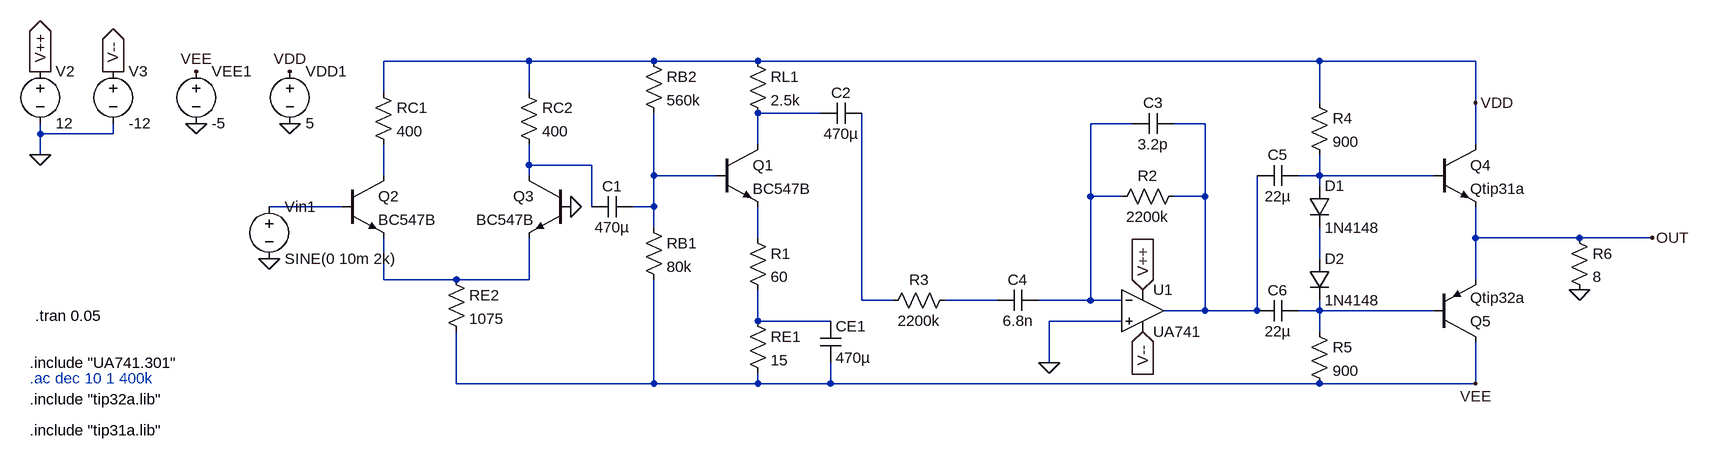
[diagram p0: schematic final.asc]
final.asc, the LTspice schematic file:
Version 4
SHEET 1 2324 1224
WIRE 528 480 304 480
WIRE 720 480 528 480
WIRE 880 480 720 480
WIRE 1744 480 880 480
WIRE 1984 480 1744 480
WIRE 304 528 304 480
WIRE 528 528 528 480
WIRE 1744 544 1744 480
WIRE 1984 544 1984 480
WIRE 976 560 880 560
WIRE 1456 576 1392 576
WIRE 1568 576 1520 576
WIRE -224 592 -224 576
WIRE -112 592 -112 576
WIRE -112 592 -224 592
WIRE 880 608 880 560
WIRE 1984 608 1984 544
WIRE -224 624 -224 592
WIRE 528 640 528 608
WIRE 624 640 528 640
WIRE 304 656 304 608
WIRE 528 656 528 640
WIRE 720 656 720 560
WIRE 816 656 720 656
WIRE 1744 656 1744 624
WIRE 1744 656 1712 656
WIRE 1920 656 1744 656
WIRE 1744 672 1744 656
WIRE 1392 688 1392 576
WIRE 1440 688 1392 688
WIRE 1568 688 1568 576
WIRE 1568 688 1520 688
WIRE 240 704 128 704
WIRE 624 704 624 640
WIRE 720 704 720 656
WIRE 720 704 688 704
WIRE 720 736 720 704
WIRE 880 752 880 704
WIRE 1984 752 1984 704
WIRE 2144 752 1984 752
WIRE 2256 752 2144 752
WIRE 1744 784 1744 736
WIRE 304 816 304 752
WIRE 416 816 304 816
WIRE 528 816 528 752
WIRE 528 816 416 816
WIRE 1984 816 1984 752
WIRE 1040 848 1040 560
WIRE 1088 848 1040 848
WIRE 1248 848 1168 848
WIRE 1392 848 1392 688
WIRE 1392 848 1312 848
WIRE 1440 848 1392 848
WIRE 1568 864 1568 688
WIRE 1568 864 1504 864
WIRE 1648 864 1648 656
WIRE 1648 864 1568 864
WIRE 1744 864 1744 848
WIRE 1744 864 1712 864
WIRE 1920 864 1744 864
WIRE 880 880 880 832
WIRE 992 880 880 880
WIRE 1440 880 1328 880
WIRE 1744 896 1744 864
WIRE 1328 944 1328 880
WIRE 416 976 416 896
WIRE 720 976 720 816
WIRE 720 976 416 976
WIRE 880 976 880 960
WIRE 880 976 720 976
WIRE 992 976 992 944
WIRE 992 976 880 976
WIRE 1744 976 992 976
WIRE 1984 976 1984 912
WIRE 1984 976 1744 976
FLAG 16 576 0
FLAG 16 496 VEE
FLAG 160 496 VDD
FLAG 160 576 0
FLAG 128 784 0
FLAG 1328 944 0
FLAG -224 624 0
FLAG -224 496 V++
IOPIN -224 496 Out
FLAG -112 496 V--
IOPIN -112 496 Out
FLAG 1472 832 V++
IOPIN 1472 832 In
FLAG 1472 896 V--
IOPIN 1472 896 In
FLAG 1984 544 VDD
FLAG 1984 976 VEE
FLAG 2144 832 0
FLAG 2256 752 OUT
FLAG 592 704 0
DATAFLAG 1888 976 ""
DATAFLAG 1888 480 ""
DATAFLAG 2224 752 ""
DATAFLAG 2224 752 ""
DATAFLAG 2224 752 ""
DATAFLAG 2224 752 ""
DATAFLAG 2224 752 ""
DATAFLAG 2224 752 ""
SYMBOL voltage 16 480 R0
WINDOW 123 0 0 Left 0
WINDOW 39 0 0 Left 0
SYMATTR InstName VEE1
SYMATTR Value -5
SYMBOL voltage 160 480 R0
WINDOW 123 0 0 Left 0
WINDOW 39 0 0 Left 0
SYMATTR InstName VDD1
SYMATTR Value 5
SYMBOL npn 816 608 R0
SYMATTR InstName Q1
SYMATTR Value BC547B
SYMBOL res 864 864 R0
SYMATTR InstName RE1
SYMATTR Value 15
SYMBOL cap 976 880 R0
SYMATTR InstName CE1
SYMATTR Value 470µ
SYMBOL res 704 720 R0
SYMATTR InstName RB1
SYMATTR Value 80k
SYMBOL cap 688 688 R90
WINDOW 0 0 32 VBottom 2
WINDOW 3 32 32 VTop 2
SYMATTR InstName C1
SYMATTR Value 470µ
SYMBOL res 704 464 R0
SYMATTR InstName RB2
SYMATTR Value 560k
SYMBOL res 864 464 R0
SYMATTR InstName RL1
SYMATTR Value 2.5k
SYMBOL cap 1040 544 R90
WINDOW 0 0 32 VBottom 2
WINDOW 3 32 32 VTop 2
SYMATTR InstName C2
SYMATTR Value 470µ
SYMBOL npn 240 656 R0
SYMATTR InstName Q2
SYMATTR Value BC547B
SYMBOL npn 592 656 M0
SYMATTR InstName Q3
SYMATTR Value BC547B
SYMBOL res 400 800 R0
SYMATTR InstName RE2
SYMATTR Value 1075
SYMBOL voltage 128 688 R0
WINDOW 123 0 0 Left 0
WINDOW 39 0 0 Left 0
SYMATTR InstName Vin1
SYMATTR Value SINE(0 10m 2k)
SYMBOL res 288 512 R0
SYMATTR InstName RC1
SYMATTR Value 400
SYMBOL res 512 512 R0
SYMATTR InstName RC2
SYMATTR Value 400
SYMBOL res 864 736 R0
SYMATTR InstName R1
SYMATTR Value 60
SYMBOL res 1536 672 R90
WINDOW 0 0 56 VBottom 2
WINDOW 3 32 56 VTop 2
SYMATTR InstName R2
SYMATTR Value 2200k
SYMBOL cap 1520 560 R90
WINDOW 0 0 32 VBottom 2
WINDOW 3 32 32 VTop 2
SYMATTR InstName C3
SYMATTR Value 3.2p
SYMBOL cap 1312 832 R90
WINDOW 0 0 32 VBottom 2
WINDOW 3 32 32 VTop 2
SYMATTR InstName C4
SYMATTR Value 6.8n
SYMBOL res 1184 832 R90
WINDOW 0 0 56 VBottom 2
WINDOW 3 32 56 VTop 2
SYMATTR InstName R3
SYMATTR Value 2200k
SYMBOL OpAmps\\opamp2 1472 800 R0
SYMATTR InstName U1
SYMATTR Value UA741
SYMBOL voltage -224 480 R0
WINDOW 123 0 0 Left 0
WINDOW 39 0 0 Left 0
SYMATTR InstName V2
SYMATTR Value 12
SYMBOL voltage -112 480 R0
WINDOW 123 0 0 Left 0
WINDOW 39 0 0 Left 0
SYMATTR InstName V3
SYMATTR Value -12
SYMBOL diode 1728 672 R0
SYMATTR InstName D1
SYMATTR Value 1N4148
SYMBOL diode 1728 784 R0
SYMATTR InstName D2
SYMATTR Value 1N4148
SYMBOL res 1728 528 R0
SYMATTR InstName R4
SYMATTR Value 900
SYMBOL res 1728 880 R0
SYMATTR InstName R5
SYMATTR Value 900
SYMBOL npn 1920 608 R0
SYMATTR InstName Q4
SYMATTR Value Qtip31a
SYMBOL pnp 1920 912 M180
SYMATTR InstName Q5
SYMATTR Value Qtip32a
SYMBOL cap 1712 640 R90
WINDOW 0 0 32 VBottom 2
WINDOW 3 32 32 VTop 2
SYMATTR InstName C5
SYMATTR Value 22µ
SYMBOL cap 1712 848 R90
WINDOW 0 0 32 VBottom 2
WINDOW 3 32 32 VTop 2
SYMATTR InstName C6
SYMATTR Value 22µ
SYMBOL res 2128 736 R0
SYMATTR InstName R6
SYMATTR Value 8
TEXT -232 872 Left 2 !.tran 0.05
TEXT -240 944 Left 2 !.include "UA741.301"
TEXT -240 968 Left 2 ;.ac dec 10 1 400k
TEXT -240 1048 Left 2 !.include "tip31a.lib"
TEXT -240 1000 Left 2 !.include "tip32a.lib"

The netlist it stands for:
* final.asc
VEE1 VEE 0 -5
VDD1 VDD 0 5
Q1 N001 N006 N009 0 BC547B
RE1 N015 VEE 15
CE1 N015 VEE 470µ
RB1 N006 VEE 80k
C1 N006 N004 470µ
RB2 VDD N006 560k
RL1 VDD N001 2.5k
C2 N012 N001 470µ
Q2 N005 N008 N011 0 BC547B
Q3 N004 0 N011 0 BC547B
RE2 N011 VEE 1075
Vin1 N008 0 SINE(0 10m 2k)
RC1 VDD N005 400
RC2 VDD N004 400
R1 N009 N015 60
R2 N003 N002 2200k
C3 N003 N002 3.2p
C4 N002 N013 6.8n
R3 N013 N012 2200k
XU1 0 N002 V++ V-- N003 UA741  ; pins In+ In- V+ V- OUT
V2 V++ 0 12
V3 V-- 0 -12
D1 N007 N010 1N4148
D2 N010 N014 1N4148
R4 VDD N007 900
R5 N014 VEE 900
Q4 VDD N007 OUT 0 Qtip31a
Q5 VEE N014 OUT 0 Qtip32a
C5 N007 N003 22µ
C6 N014 N003 22µ
R6 OUT 0 8
.model D D
.lib standard.dio
.model NPN NPN
.model PNP PNP
.lib standard.bjt
.tran 0.05
.include "UA741.301"
* .ac dec 10 1 400k
.include "tip31a.lib"
.include "tip32a.lib"
.backanno
.end